# EAGLE design Projet_Elec (EAGLE 9.5.2)
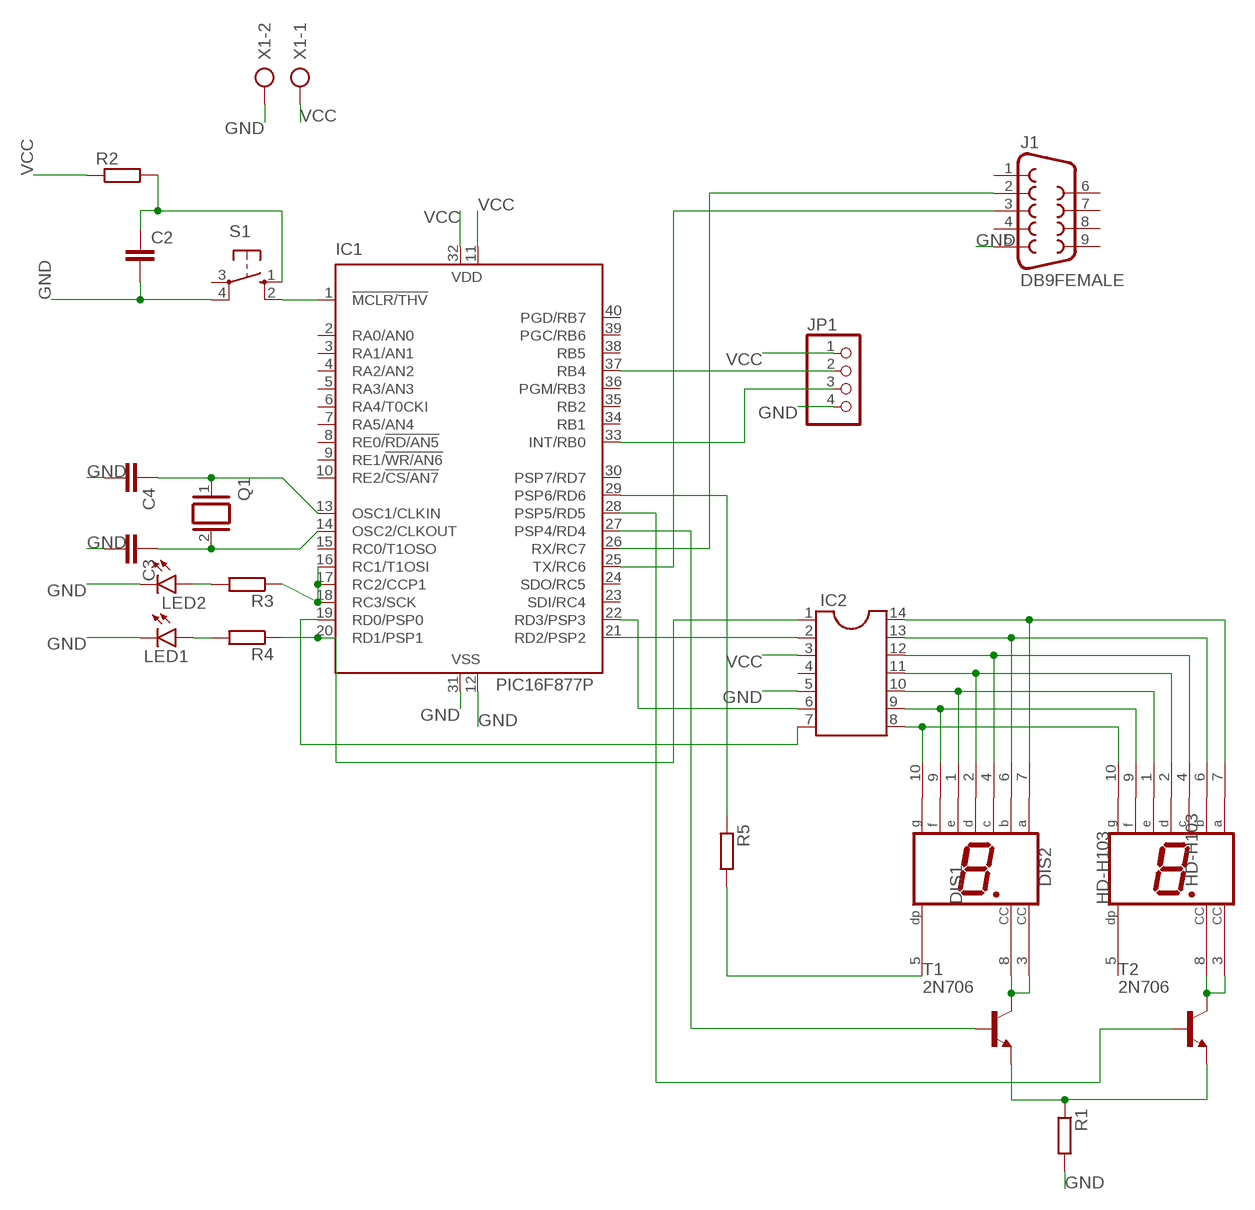
[diagram p0: schematic, sheet 1]

## Parts
C2  C-EU025-024X044  [C025-024X044]
C3  C-EU025-024X044  [C025-024X044]
C4  C-EU025-024X044  [C025-024X044]
DIS1  HD-H103  [HDSP-M]
DIS2  HD-H103  [HDSP-M]
IC1  PIC16F877P  [DIL40]
IC2  DIL14  [DIL14]
J1  DB9FEMALE  [DB9]
JP1  PINHD-1X4  [1X04]
LED1  LED5MM  [LED5MM]
LED2  LED5MM  [LED5MM]
Q1  XTAL/S  [QS]
R1  R-EU_0204/7  [0204/7]
R2  R-EU_0204/7  [0204/7]
R3  R-EU_0204/7  [0204/7]
R4  R-EU_0204/7  [0204/7]
R5  R-EU_0204/7  [0204/7]
S1  10-XX  [B3F-10XX]
T1  2N706  [TO18]
T2  2N706  [TO18]
X1  AK300/2  [AK300/2]

## Nets
GND: C2.2 C3.2 C4.2 IC1.12(VSS) IC1.31(VSS) IC2.5 J1.5 JP1.4 LED1.K(C) LED2.K(C) R1.2 S1.4(P1) X1.2
N$1: IC1.1(!MCLR/THV) S1.2(S1)
N$2: C2.1 R2.2 S1.1(S)
N$3: C4.1 IC1.13(OSC1/CLKIN) Q1.1
N$4: C3.1 IC1.14(OSC2/CLKOUT) Q1.2
N$5: IC1.16(RC1/T1OSI) IC1.17(RC2/CCP1) IC1.18(RC3/SCK) R3.1
N$6: LED2.A R3.2
N$7: IC1.20(RD1/PSP1) IC2.1 R4.1
N$8: LED1.A R4.2
N$9: IC1.26(RX/RC7) J1.2
N$10: IC1.25(TX/RC6) J1.3
N$11: IC1.19(RD0/PSP0) IC2.7
N$12: DIS1.7(A) DIS2.7(A) IC2.14
N$13: DIS1.6(B) DIS2.6(B) IC2.13
N$14: DIS1.4(C) DIS2.4(C) IC2.12
N$15: DIS1.2(D) DIS2.2(D) IC2.11
N$16: DIS1.1(E) DIS2.1(E) IC2.10
N$18: DIS1.10(G) DIS2.10(G) IC2.8
N$19: DIS1.3(CC) DIS1.8(CC) T1.3(C)
N$21: IC1.37(RB4) JP1.2
N$23: IC1.27(PSP4/RD4) T1.2(B)
N$24: IC1.28(PSP5/RD5) T2.2(B)
N$26: IC1.22(RD3/PSP3) IC2.6
N$27: R1.1 T1.1(E) T2.1(E)
N$28: IC1.29(PSP6/RD6) R5.1
N$29: DIS1.5(DP) R5.2
N$31: DIS1.9(F) DIS2.9(F) IC2.9
N$33: IC1.21(RD2/PSP2) IC2.2
N$35: IC1.33(INT/RB0) JP1.3
N$37: DIS2.3(CC) DIS2.8(CC) T2.3(C)
VCC: IC1.11(VDD) IC1.32(VDD) IC2.3 JP1.1 R2.1 X1.1
Unconnected: DIS2.5(DP) IC1.2(RA0/AN0) IC1.3(RA1/AN1) IC1.4(RA2/AN2) IC1.5(RA3/AN3) IC1.6(RA4/T0CKI) IC1.7(RA5/AN4) IC1.8(RE0/!RD/AN5) IC1.9(RE1/!WR/AN6) IC1.10(RE2/!CS/AN7) IC1.15(RC0/T1OSO) IC1.23(SDI/RC4) IC1.24(SDO/RC5) IC1.30(PSP7/RD7) IC1.34(RB1) IC1.35(RB2) IC1.36(PGM/RB3) IC1.38(RB5) IC1.39(PGC/RB6) IC1.40(PGD/RB7) IC2.4 J1.1 J1.4 J1.6 J1.7 J1.8 J1.9 S1.3(P)

## Library data of the parts
C2-C4 = rcl:C-EU: CAPACITOR, European symbol; SPICEPREFIX: C
DIS1 DIS2 = display-hp:HD-H103: LED DISPLAY 1-character 7 segment, decimal point right; OC_FARNELL: unknown; OC_NEWARK: unknown
IC1 = microchip:PIC16F87*: MICROCONTROLLER; MF: MICROCHIP; MPN: PIC16F877-04/P; OC_FARNELL: 9761349; OC_NEWARK: 61K3463
IC2 = ic-package:DIL14: Dual In Line / Socket
J1 = DB9:DB9: DB9 Connector Standard DB9 (D-Sub 9) serial connector. Can be used for CAN bus as well as RS485 and RS232. Footprint production proven. Spark Fun Electronics SKU : PRT-00429; AVAILABILITY: Unavailable; DESCRIPTION: Tripp Lite DB9 Network In-Line Dataline Surge Protector 120V / 230V 9-PIN DB9; MF: Tripp Lite; MP: DB9; PACKAGE: None; PRICE: None
JP1 = pinhead:PINHD-1X4: PIN HEADER
LED1 LED2 = led:LED: LED OSRAM: - CHIPLED LG R971, LG N971, LY N971, LG Q971, LY Q971, LO R971, LY R971 LH N974, LH R974 LS Q976, LO Q976, LY Q976 LO Q996 - Hyper CHIPLED LW Q18S LB Q993, LB Q99A, LB R99A - SideLED LS A670, LO A670, LY A670, LG A670, LP A670 LB A673, LV A673, LT A673, LW A673 LH A674 LY A675 LS A676, LA A676, LO A676, LY A676, LW A676 LS A679, LY A679, LG A679 - Hyper Micro SIDELED® LS Y876, LA Y876, LO Y876, LY Y876 LT Y87S - SmartLED LW L88C, LW L88S LB L89C, LB L89S, LG L890 LS L89K, LO L89K, LY L89K LS L896, LA L896, LO L896, LY L896 - TOPLED LS T670, LO T670, LY T670, LG T670, LP T670 LSG T670, LSP T670, LSY T670, LOP T670, LYG T670 LG T671, LOG T671, LSG T671 LB T673, LV T673, LT T673, LW T673 LH T674 LS T676, LA T676, LO T676, LY T676, LB T676, LH T676, LSB T676, LW T676 LB T67C, LV T67C, LT T67C, LS T67K, LO T67K, LY T67K, LW E67C LS E67B, LA E67B, LO E67B, LY E67B, LB E67C, LV E67C, LT E67C LW T67C LS T679, LY T679, LG T679 LS T770, LO T770, LY T770, LG T770, LP T770 LB T773, LV T773, LT T773, LW T773 LH T774 LS E675, LA E675, LY E675, LS T675 LS T776, LA T776, LO T776, LY T776, LB T776 LHGB T686 LT T68C, LB T68C - Hyper Mini TOPLED® LB M676 - Mini TOPLED Santana® LG M470 LS M47K, LO M47K, LY M47K Source: http://www.osram.convergy.de LUXEON: - LUMILED® LXK2-PW12-R00, LXK2-PW12-S00, LXK2-PW14-U00, LXK2-PW14-V00 LXK2-PM12-R00, LXK2-PM12-S00, LXK2-PM14-U00 LXK2-PE12-Q00, LXK2-PE12-R00, LXK2-PE12-S00, LXK2-PE14-T00, LXK2-PE14-U00 LXK2-PB12-K00, LXK2-PB12-L00, LXK2-PB12-M00, LXK2-PB14-N00, LXK2-PB14-P00, LXK2-PB14-Q00 LXK2-PR12-L00, LXK2-PR12-M00, LXK2-PR14-Q00, LXK2-PR14-R00 LXK2-PD12-Q00, LXK2-PD12-R00, LXK2-PD12-S00 LXK2-PH12-R00, LXK2-PH12-S00 LXK2-PL12-P00, LXK2-PL12-Q00, LXK2-PL12-R00 Source: www.luxeon.com KINGBRIGHT: KA-3528ASYC Source: www.kingbright.com
Q1 = special:XTAL/S: CRYSTAL
R1-R5 = rcl:R-EU_: RESISTOR, European symbol; SPICEPREFIX: R
S1 = switch-omron:10-XX: OMRON SWITCH; MPN: B3F-1000; OC_FARNELL: 176432; OC_NEWARK: 36M3542
T1 T2 = transistor:2N706: NPN TRANSISTOR
X1 = con-ptr500:AK300/2: CONNECTOR; OC_FARNELL: unknown; OC_NEWARK: unknown

## Board
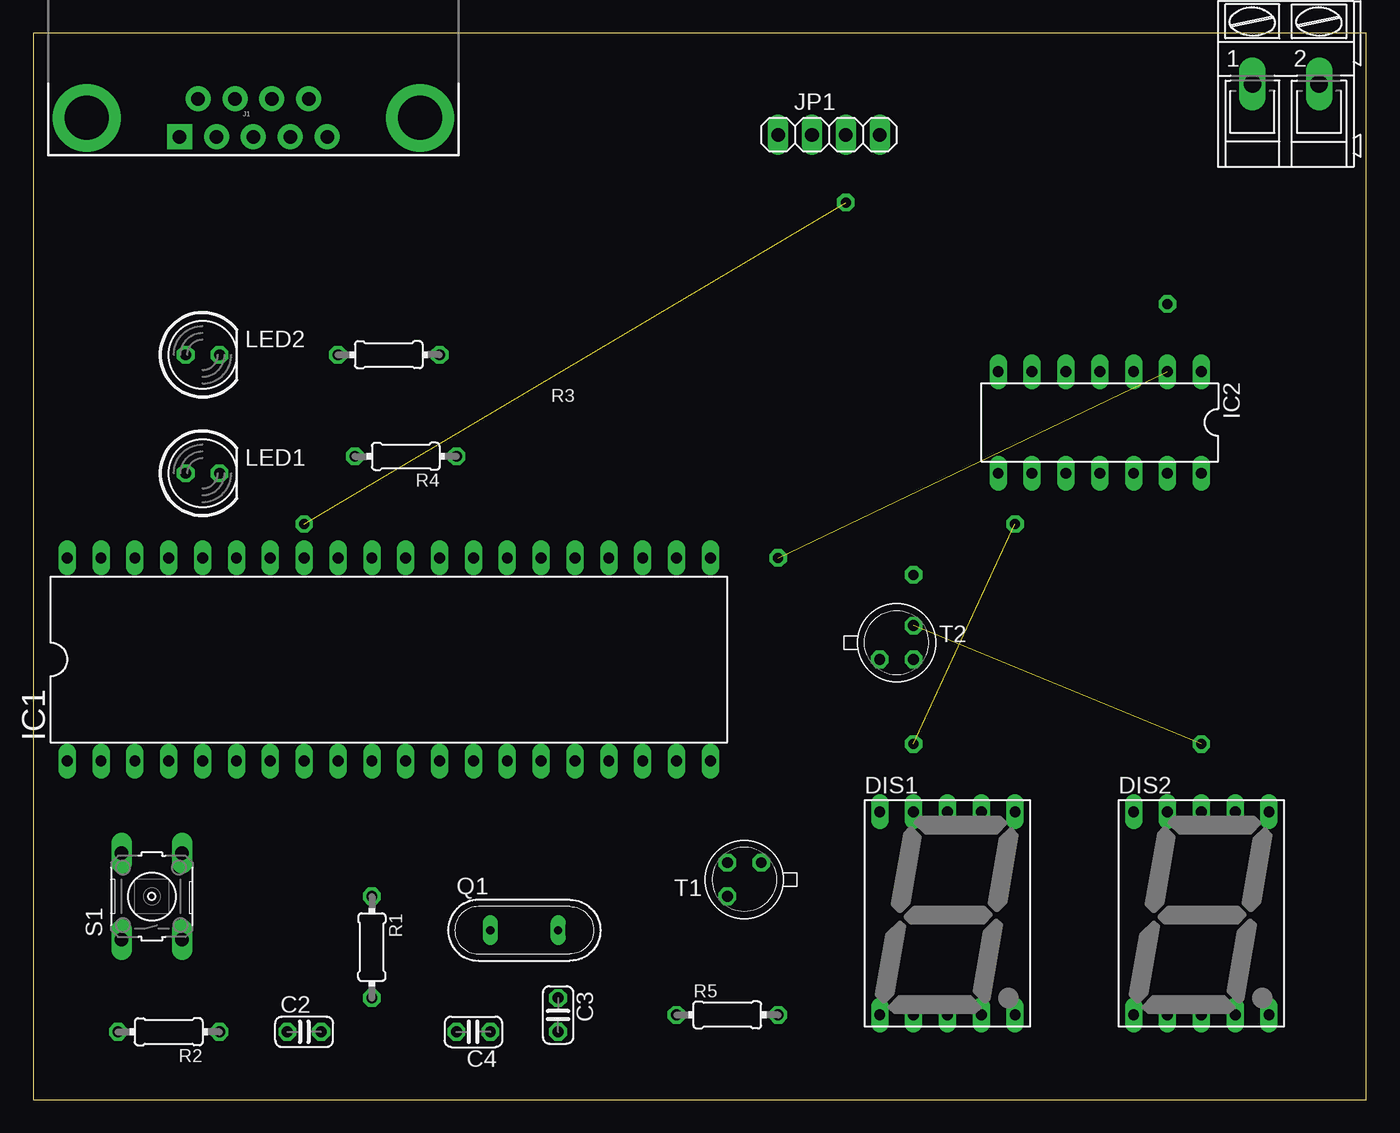
[diagram p1: board, top side]
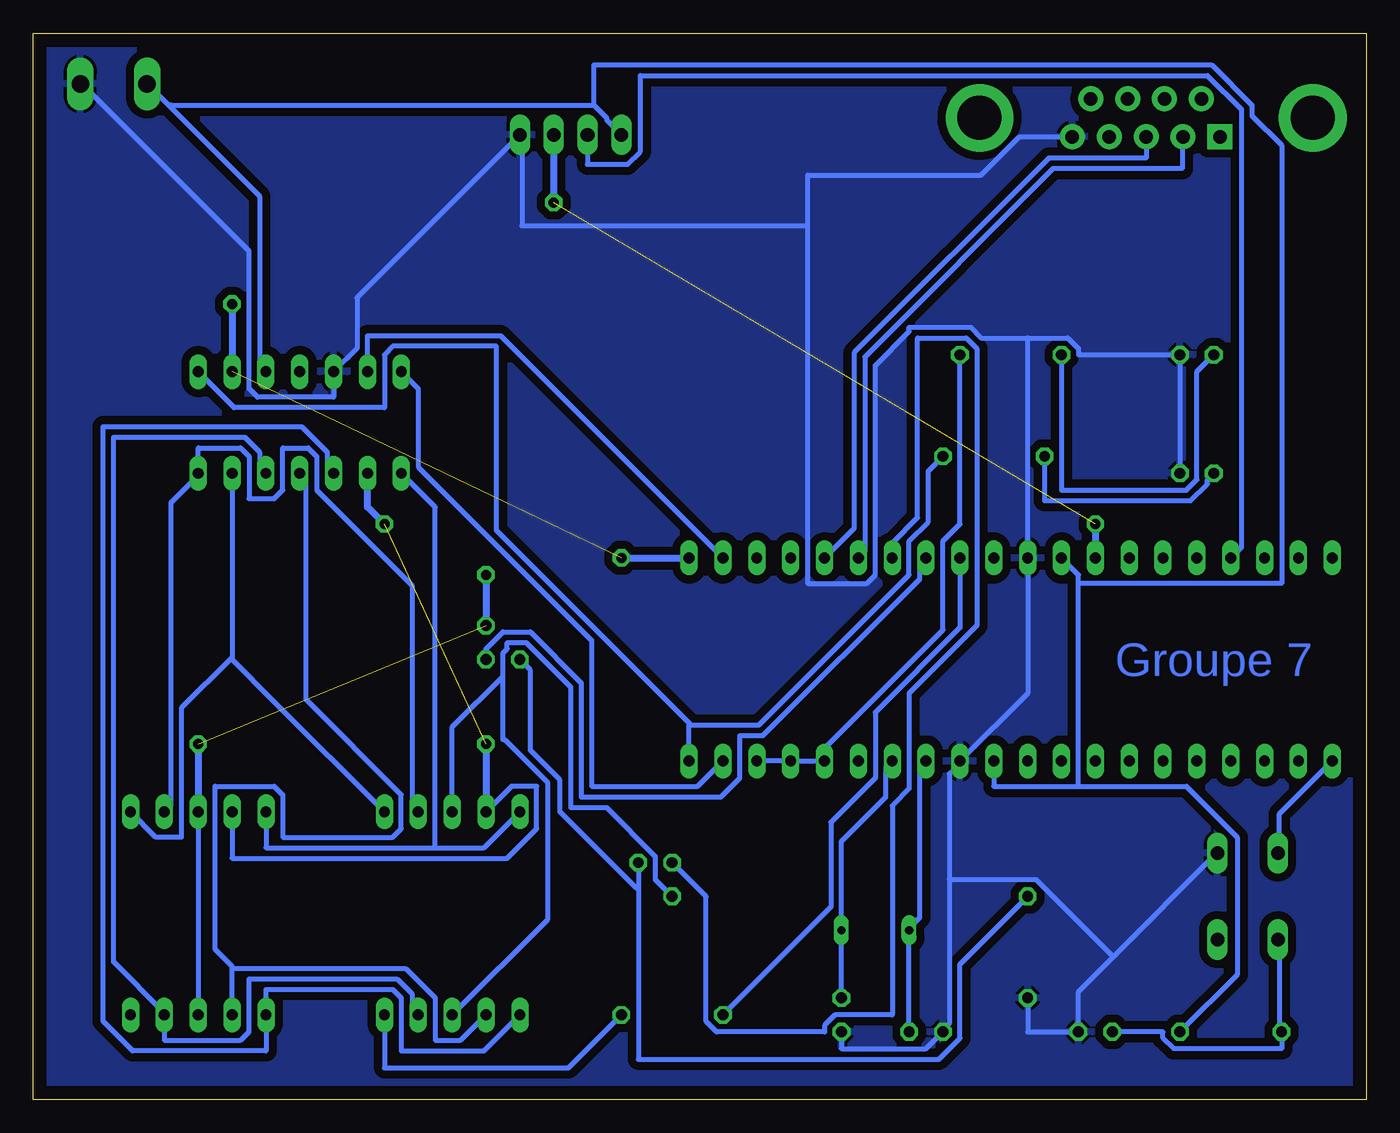
[diagram p2: board, bottom side, seen from below]

Size 100 x 80 mm. Coordinates in mm from the lower left corner, seen from the top.
Outline: 0,0 100,0 100,80 0,80 0,0
Copper layers (1*16): Top 0.035mm / dielectric 1.5mm / Bottom 0.035mm
Design rules "default *": minimum track width 15mil, minimum drill 0.35mm, track to track 15mil, track to pad 15mil, pad to pad 15mil, via to via 15mil, smd to smd 15mil, copper to edge 40mil, drill to drill 6mil, minimum pad ring 10mil, minimum via ring 8mil, stop-mask expansion 4mil, vias tented up to drill 0mil, thermal gap 10mil

### Footprints (pad centres in the part's own frame; a part is rotated, then mirrored left to right if it is on the bottom)
C025-024X044 = drill 0.813 octagon: 1 -1.27,0; 2 1.27,0
HDSP-M = drill 0.813 long: 1 -5.08,-7.62; 2 -2.54,-7.62; 3 0,-7.62; 4 2.54,-7.62; 5 5.08,-7.62; 6 5.08,7.62; 7 2.54,7.62; 8 0,7.62; 9 -2.54,7.62; 10 -5.08,7.62
DIL40 = drill 0.813 long: 1 -24.13,-7.62; 2 -21.59,-7.62; 3 -19.05,-7.62; 4 -16.51,-7.62; 5 -13.97,-7.62; 6 -11.43,-7.62; 7 -8.89,-7.62; 8 -6.35,-7.62; 9 -3.81,-7.62; 10 -1.27,-7.62; 11 1.27,-7.62; 12 3.81,-7.62; 13 6.35,-7.62; 14 8.89,-7.62; 15 11.43,-7.62; 16 13.97,-7.62; 17 16.51,-7.62; 18 19.05,-7.62; 19 21.59,-7.62; 20 24.13,-7.62; 21 24.13,7.62; 22 21.59,7.62; 23 19.05,7.62; 24 16.51,7.62; 25 13.97,7.62; 26 11.43,7.62; 27 8.89,7.62; 28 6.35,7.62; 29 3.81,7.62; 30 1.27,7.62; 31 -1.27,7.62; 32 -3.81,7.62; 33 -6.35,7.62; 34 -8.89,7.62; 35 -11.43,7.62; 36 -13.97,7.62; 37 -16.51,7.62; 38 -19.05,7.62; 39 -21.59,7.62; 40 -24.13,7.62
DIL14 = drill 0.813 long: 1 -7.62,-3.81; 2 -5.08,-3.81; 3 -2.54,-3.81; 4 0,-3.81; 5 2.54,-3.81; 6 5.08,-3.81; 7 7.62,-3.81; 8 7.62,3.81; 9 5.08,3.81; 10 2.54,3.81; 11 0,3.81; 12 -2.54,3.81; 13 -5.08,3.81; 14 -7.62,3.81
DB9 = drill 1.016 pad 1.88 square: 1 -5.54,-1.42 | drill 1.016 pad 1.88: 2 -2.77,-1.42; 3 0,-1.42; 4 2.77,-1.42; 5 5.54,-1.42; 6 -4.15,1.42; 7 -1.38,1.42; 8 1.38,1.42; 9 4.15,1.42 | drill 3.302 pad 5.08: G1 -12.5,0; G2 12.5,0
1X04 = drill 1.016 long: 1 -3.81,0; 2 -1.27,0; 3 1.27,0; 4 3.81,0
LED5MM = drill 0.813 octagon: A -1.27,0; K 1.27,0
QS = drill 0.61 long: 1 -2.54,0; 2 2.54,0
0204/7 = drill 0.813 octagon: 1 -3.81,0; 2 3.81,0
B3F-10XX = drill 1.016 long: 1 -3.251,2.261; 2 3.251,2.261; 3 -3.251,-2.261; 4 3.251,-2.261
TO18 = drill 0.813 octagon: 1 -1.27,-1.27; 2 1.27,-1.27; 3 1.27,1.27
AK300/2 = drill 1.321 long: 1 -2.515,0; 2 2.489,0

### Placement (x,y rotation side)
C2  20.32,5.08 0 top
C3  39.37,6.35 270 top
C4  33.02,5.08 180 top
DIS1  68.58,13.97 0 top
DIS2  87.63,13.97 0 top
IC1  26.67,33.02 0 top
IC2  80.01,50.8 180 top
J1  16.51,73.66 0 top
JP1  59.69,72.39 0 top
LED1  12.7,46.99 0 top
LED2  12.7,55.88 0 top
Q1  36.83,12.7 0 top
R1  25.4,11.43 270 top
R2  10.16,5.08 180 top
R3  26.67,55.88 180 top
R4  27.94,48.26 180 top
R5  52.07,6.35 0 top
S1  8.89,15.24 90 top
T1  53.34,16.51 180 top
T2  64.77,34.29 0 top
X1  93.98,76.2 0 top

### Tracks (layer width: path | path; a pad name or v marks a point on that pad's centre or on a via)
GND
  Bottom 0.381: R1.2 25.4,5.08 C2.2 21.59,8.1 18.97,10.72 | 18.97,10.72 11.27,18.41 S1.4 | LED1.K LED2.K 21.59,55.88 21.59,56.36 22.38,57.15 25.4,57.15 | C3.2 39.37,3.81 33.02,3.81 C4.2 31.75,5.24 31.27,5.71 31.27,16.51 | 31.27,16.51 31.27,24.45 30.48,25.24 IC1.12 25.4,30.48 IC1.31 25.4,57.15 | 18.97,10.72 24.77,16.51 31.27,16.51 | 41.91,65.56 63.34,65.56 63.34,72.39 JP1.4 75.72,60.17 75.72,56.36 IC2.5 77.47,52.7 83.19,52.7 83.82,53.34 83.82,63.66 96.36,76.2 X1.2 | J1.5 22.07,72.23 26.04,72.23 28.89,69.37 41.91,69.37 41.91,65.56 | 25.4,57.15 28.89,57.15 29.69,57.94 34.29,57.94 34.29,57.63 36.83,55.09 36.83,39.37 37.47,38.73 41.91,38.73 41.91,65.56
  pour Bottom (isolate 0.61): 0,80.01 100.33,80.01 100.33,0 0,0
N$1
  Bottom 0.381: IC1.1 6.51,21.43 6.51,18.57 S1.2
N$2
  Bottom 0.381: S1.1 6.51,11.91 6.51,5.24 R2.2 6.35,3.81 14.45,3.81 15.24,4.6 15.24,5.08 C2.1
N$3
  Bottom 0.381: C4.1 Q1.1 34.29,12.86 33.5,13.65 33.5,24.92 IC1.13
N$4
  Bottom 0.381: C3.1 Q1.2 39.37,19.37 36.04,22.7 36.04,24.92 IC1.14
N$5
  Bottom 0.381: IC1.18 IC1.17 IC1.16 40.64,26.35 31.75,35.24 31.75,41.91 30.48,43.18 R3.1
N$6
  Bottom 0.381: LED2.A 12.7,54.61 12.7,46.51 13.49,45.72 22.86,45.72 R3.2
N$7
  Bottom 0.381: R4.1 32.86,47.15 32.86,43.34 34.29,41.91 34.29,39.37 45.56,28.1 50.8,28.1 | IC1.20 50.8,28.1 | IC2.1 84.93,51.91 73.66,51.91 73.66,55.88 73.03,56.52 65.25,56.52 65.25,42.7 50.8,28.26 50.8,28.1
N$8
  Bottom 0.381: LED1.A 11.91,46.51 11.91,46.2 13.18,44.93 24.13,44.93 R4.2
N$9
  Bottom 0.381: IC1.26 37.62,41.12 37.62,55.72 23.5,69.85 13.81,69.85 13.81,72.23 J1.2
N$10
  Bottom 0.381: IC1.25 38.42,42.86 38.42,56.04 23.81,70.64 16.51,70.64 J1.3
N$11
  Bottom 0.381: IC1.19 50.16,23.5 58.1,23.5 58.1,34.45 71.12,47.47 71.12,53.34 IC2.7
N$12
  Bottom 0.381: DIS1.7 71.6,22.07 71.6,38.58 78.74,45.72 78.74,48.26 79.38,48.9 81.28,48.9 81.28,45.72 81.92,45.09 83.82,45.09 83.82,48.26 84.45,48.9 87.63,48.9 IC2.14 87.63,46.83 89.69,44.77 89.69,22.07 DIS2.7
N$13
  Bottom 0.381: 85.09,33.02 81.99,29.92 DIS1.6 | 85.09,33.02 85.17,33.1 88.9,29.37 88.9,19.68 90.81,19.68 DIS2.6 | IC2.13 85.09,33.02
N$14
  Bottom 0.381: DIS1.4 71.6,6.83 71.6,7.94 72.71,9.05 83.82,9.05 83.82,5.08 84.45,4.45 90.17,4.45 DIS2.4 90.17,6.51 93.98,10.32 93.98,49.69 84.14,49.69 83.03,48.58 83.03,47.47 IC2.12
N$15
  Bottom 0.381: DIS1.2 67.94,4.45 69.85,4.45 69.85,7.62 72.07,9.84 85.09,9.84 | DIS2.2 85.09,9.84 | IC2.11 79.53,46.51 79.53,30 72.39,22.86 72.39,20.32 73.03,19.68 81.28,19.68 81.28,22.86 81.92,23.5 86.36,23.5 86.36,11.27 85.09,10 85.09,9.84
N$16
  Bottom 0.381: DIS1.1 66.2,3.65 72.39,3.65 72.39,7.62 73.03,8.26 82.55,8.26 DIS2.1 82.55,3.65 92.55,3.65 94.77,5.87 94.77,50.48 79.85,50.48 77.95,48.58 77.95,47.47 IC2.10
N$18
  Bottom 0.381: DIS1.10 66.2,18.89 69.85,18.89 | 69.85,18.89 82.55,18.89 DIS2.10 | IC2.8 69.85,44.45 69.85,18.89
N$19
  Bottom 0.381: T1.3 53.34,16.51 53.34,18.26 56.99,21.91 59.69,21.91 59.69,30.96 63.02,34.29 64.45,34.29 64.45,33.81 64.77,33.5 64.77,31.75 | 64.77,31.75 64.77,26.99 64.61,26.99 61.44,23.81 61.44,13.49 DIS1.3 | DIS1.8 68.58,27.94 64.77,31.75
N$21
  Bottom 0.381: IC1.37 9.37,41.43 9.37,74.3 11.91,76.83 54.45,76.83 54.45,71.12 55.4,70.17 58.42,70.17 JP1.2
N$23
  Bottom 0.381: T1.2 49.53,15.24 49.53,5.87 48.74,5.08 40.64,5.08 40.64,5.56 39.85,6.35 35.56,6.35 35.56,22.07 34.29,23.34 34.29,30.48 29.21,35.56 29.21,56.36 30,57.15 33.66,57.15 33.66,43.66 35.56,41.75 IC1.27
N$24
  Bottom 0.381: IC1.28 33.5,40.16 33.5,39.05 45.24,27.3 46.99,27.3 46.99,24.13 48.42,22.7 58.9,22.7 58.9,31.27 62.71,35.08 64.77,35.08 66.04,33.81 T2.2
N$26
  Bottom 0.381: IC1.22 64.93,57.31 74.93,57.31 IC2.6
N$27
  Bottom 0.381: R1.1 30.48,10.16 30.48,4.6 32.07,3.02 54.61,3.02 54.61,15.88 | T1.1 54.61,15.88 | T2.1 62.71,32.23 62.71,26.19 60.48,23.97 60.48,21.59 54.77,15.88 54.61,15.88
N$28
  Bottom 0.381: R5.1 40.16,14.45 40.16,20.8 36.83,24.13 36.83,29.05 30.48,35.4 IC1.29
N$29
  Bottom 0.381: R5.2 59.85,2.38 73.66,2.38 DIS1.5
N$31  (via drill 0.75 pad 1.3)  (1 unrouted)
  Bottom 0.381: DIS1.9 64.14,23.5 62.23,23.5 62.23,20.32 64.45,18.1 85.09,18.1 DIS2.9
  Bottom 0.508: v73.66,43.18 74.93,44.45 IC2.9 | v66.04,26.67 DIS1.9
N$33  (via drill 0.75 pad 1.3)  (1 unrouted)
  Bottom 0.508: v55.88,40.64 IC1.21 | v85.09,59.69 IC2.2
N$35  (via drill 0.75 pad 1.3)  (1 unrouted)
  Bottom 0.508: v20.32,43.18 IC1.33 | JP1.3 v60.96,67.31
N$37  (via drill 0.75 pad 1.3)  (1 unrouted)
  Bottom 0.381: DIS2.8 DIS2.3
  Bottom 0.508: v87.63,26.67 DIS2.8 | v66.04,39.37 T2.3
VCC
  Bottom 0.381: R2.1 9.68,9.37 9.68,19.68 13.49,23.5 21.59,23.5 | 21.59,23.5 27.94,23.5 IC1.11 | IC1.32 21.59,39.37 21.59,38.73 | 21.59,23.5 21.59,38.73 | IC2.3 83.03,55.09 83.03,67.79 89.77,74.53 | 89.77,74.53 91.44,76.2 X1.1 | JP1.1 56.99,73.5 56.99,73.66 57.94,74.61 | 57.94,74.61 89.69,74.61 89.77,74.53 | 21.59,38.73 6.35,38.73 6.35,71.6 8.57,73.82 8.57,74.61 11.59,77.63 57.94,77.63 57.94,74.61

### Text on the board
Bottom: Groupe 7